# Altium schematic sheet Vcc.SchDoc
size A
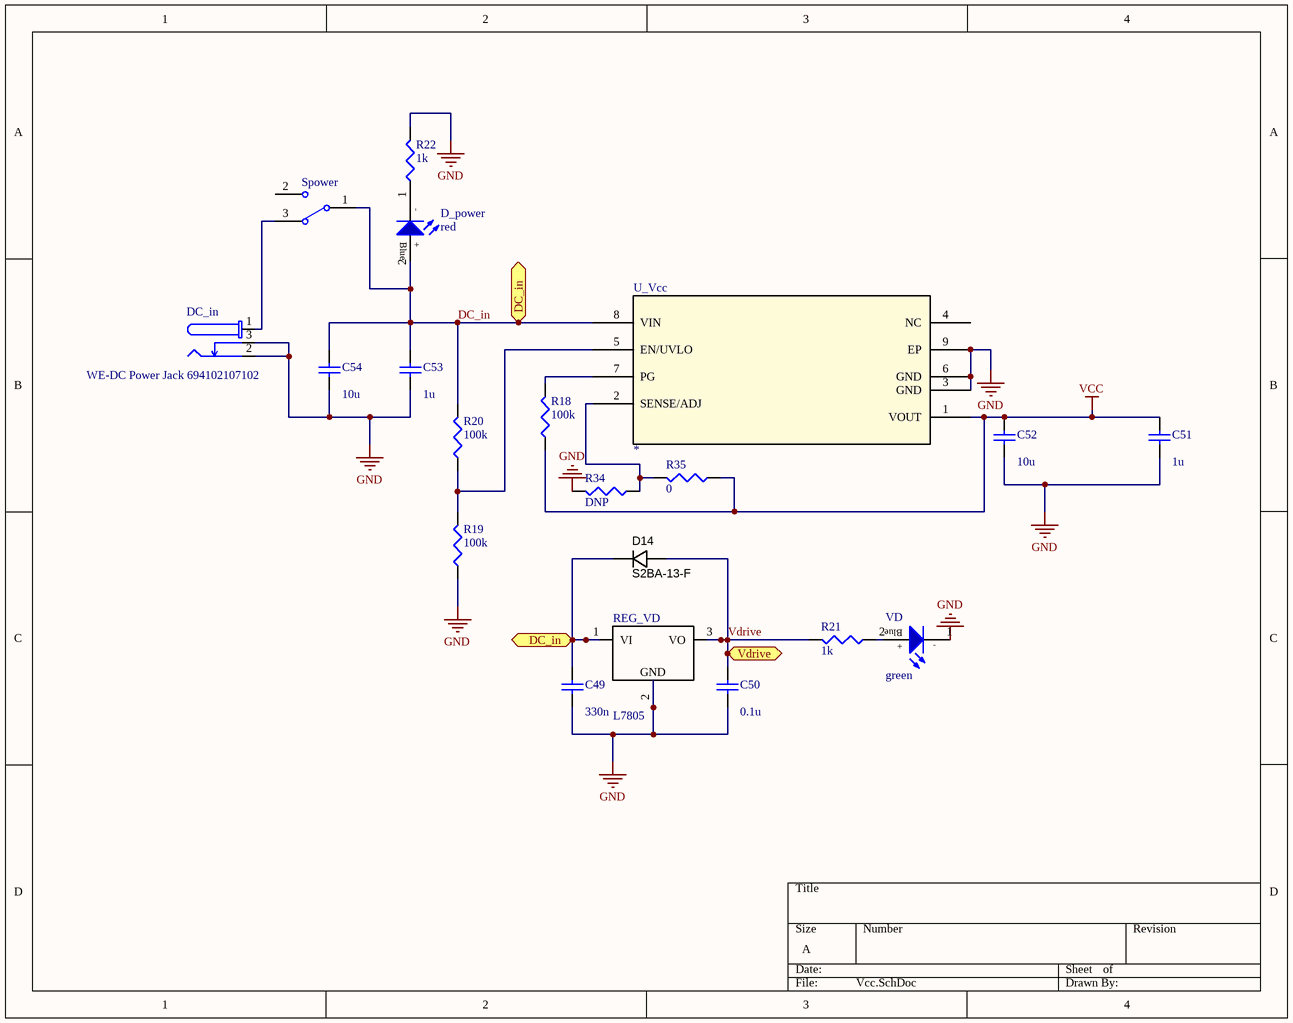
[diagram p0: Vcc.SchDoc]

## Parts
C49  value 330n  [0805]
C50  value 0.1u  [0603]
C51  value 1u  [0603]
C52  value 10u  [0805]
C53  value 1u  [0603]
C54  value 10u  [0805]
D14  Manufacturer Part Number 1: S2BA-13-F  [DO-214AC]  (hidden comment: 100V; 1.5A)
D_power  red  [WL-SMCW_0603]
DC_in  WE-DC Power Jack 694102107102  [694102107102]
R18  value 100k  [J1-0603]
R19  value 100k  [J1-0603]
R20  value 100k  [J1-0603]
R21  value 1k  [J1-0603]
R22  value 1k  [J1-0603]
R34  value DNP  [J1-0603]
R35  value 0  [J1-0603]
REG_VD  L7805  [DPAK]
Spower  (no value)  [450301014042]
U_Vcc  *  [RD_8_2]
VD  green  [WL-SMCW_0603]

## Ports
DC_in, Vdrive

## Nets
GND: C49.2 C50.1 C51.1 C52.2 C53.2 C54.2 DC_in.2 DC_in.3 R19.1 R22.2 R34.2 REG_VD.2 U_Vcc.3(GND) U_Vcc.6(GND) U_Vcc.9(EP) VD.1(-)
VCC: C51.2 C52.1 R18.1 R35.1 U_Vcc.1(VOUT)
DC_in: C49.1 C53.1 C54.1 D14.K D_power.2(+) R20.2 REG_VD.1(VI) Spower.1(COM) U_Vcc.8(VIN) ; port DC_in
Vdrive: C50.2 D14.A R21.2 REG_VD.3(VO) ; port Vdrive
NetD_power_1: D_power.1(-) R22.1
NetDC_in_1: DC_in.1 Spower.3
NetR18_2: R18.2 U_Vcc.7(PG)
NetR19_2: R19.2 R20.1 U_Vcc.5(EN/UVLO)
NetR21_1: R21.1 VD.2(+)
NetR34_1: R34.1 R35.2 U_Vcc.2(SENSE/ADJ)

Not connected (* = marked no-connect by the designer): Spower 2; U_Vcc 4(NC)

## Notes on the sheet
- (in symbol L7805-DPAK) GND
- (in symbol WL-SMCW 0603, 150060BS75000) Blue

## Library data of the parts
C49 C52 C54 = C0805: Ceramic Chip Capacitor - Standard; Note: Footprint corresponds to dimensions for bulk cassette packaging. This case size has tightened tolerances.; ComponentLink1Description: Manufacturer Link; ComponentLink1URL: http://www.kemet.com/; ComponentLink2Description: Datasheet; ComponentLink2URL: http://www.kemet.com/kemet/web/homepage/kechome.nsf/vapubfilesname/F3102TA.pdf/$file/F3102TA.pdf; Published: 17-Jul-2002; LatestRevisionDate: 19-Mar-2004; LatestRevisionNote: Silkscreen size reduced.; DatasheetDocument: Mar-2001; PackageDocument: Mar-2001; PackageReference: 0805; Publisher: Altium Limited; Code_JEITA: 0805; Code_IPC: 2012[0805]
C50 C51 C53 = C0603: Ceramic Chip Capacitor - Standard; Note: Footprint corresponds to dimensions for bulk cassette packaging. This case size has tightened tolerances.; ComponentLink1Description: Manufacturer Link; ComponentLink1URL: http://www.kemet.com/; ComponentLink2Description: Datasheet; ComponentLink2URL: http://www.kemet.com/kemet/web/homepage/kechome.nsf/vapubfilesname/F3102TA.pdf/$file/F3102TA.pdf; Published: 17-Jul-2002; LatestRevisionDate: 19-Mar-2004; LatestRevisionNote: Silkscreen size reduced.; DatasheetDocument: Mar-2001; PackageDocument: Mar-2001; PackageReference: 0603; Publisher: Altium Limited; Code_JEITA: 0603; Code_IPC: 1608 [0603]
D14 = DIODE_100V_1.5A_SMA: Diode SMD 100V 1.5A SMA; Manufacturer 1: Diodes Inc; Value: Vf = 1.15V @ 1.5A (Max); Material: Si; SCDType: source; Diode Type: Standard; Package / Case: DO-214AC, SMA; Ratings: 100V; 1.5A; Supplier 1: Digi-Key; Supplier Part Number 1: S2BA-FDICT-ND
D_power VD = WL-SMCW 0603, 150060BS75000: WL-SMCW SMD chip LED top view mono-color waterclear, 0603, Blue; Manufacturer: Wurth Elektronik; PartNo: 150060BS75000; ComponentLink1Description: Manufacturer; ComponentLink1URL: http://www.we-online.de; Created by: Baojun Chen; Created Date: March 2016; ComponentLink2Description: Datasheet; ComponentLink2URL: http://katalog.we-online.de/led/datasheet/150060BS75000.pdf
DC_in = WE-DC Power Jack 694102107102: WR-DC_DC Power Jack_Right Angled_SMT; Manufacturer: W¨¹rth Elektronik eiSos GmbH; ComponentLink1 Description: Manufacturer; ComponentLink2 Description: Datasheet; NoPins: 4; ComponentLink1URL: http://www.we-online.de; ComponentLink2URL: http://katalog.we-online.de/em/datasheet/6941xx107102.pdf; Created by: Karrer Zheng; Created Date: 10/17/2014; partNo: 694102107102
R18-R22 R34 R35 = Res3: Resistor; Published: 8-Jun-2000; LatestRevisionDate: 29-May-2009; LatestRevisionNote: IPC-7351 Footprint Added.; PackageReference: J1-0603; Publisher: Altium Limited; PackageDescription: Chip Resistor
REG_VD = L7805-DPAK: LINEAR REGULATOR 5.0V; Supplier 1: Digi-Key; Supplier Part Number 1: 497-7255-6-ND
Spower = 450301014042: WS-SLTV 10x2.5 mm THT; ComponentLink1Description: Manufacturer; ComponentLink1URL: http://www.we-online.de; ComponentLink2Description: Datasheet; ComponentLink2URL: http://katalog.we-online.de/em/datasheet/450301014042.pdf; Part Number: 450301014042; Published Date: June 2017; Publisher: Wurth Elektronik
U_Vcc = ADP7104ARDZ-R7: Imported; Value: Value; Type: Type; RefDes: RefDes